# Altium project Laser Tag Bop-It.PrjPcb
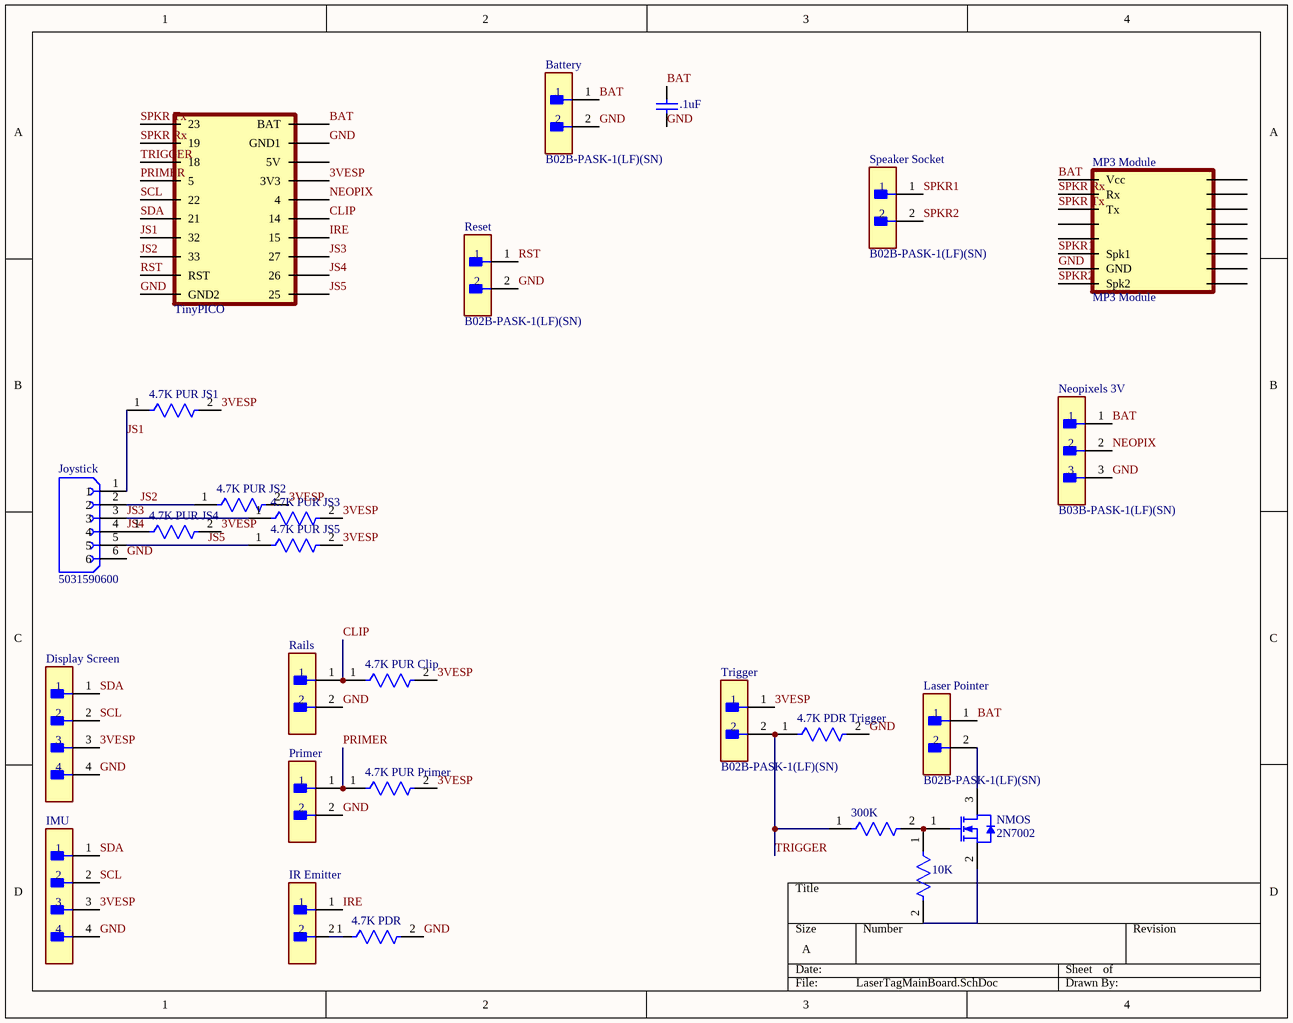
[diagram p0: LaserTagMainBoard.SchDoc]
4 sheets, 41 parts. Net scope: global (net labels, ports and power ports of the same name join across sheets).
Board files: LaserTagMainBoard.PcbDoc, LaserTagTargetBoard.PcbDoc, LaserTagNeopixelBoard.PcbDoc, LaserTagJoystickBoard.PcbDoc
Sheets:
  LaserTagMainBoard.SchDoc
  LaserTagTargetBoard.SchDoc
  LaserTagNeopixelBoard.SchDoc
  LaserTagJoystickBoard.SchDoc

## Sheet LaserTagMainBoard.SchDoc
size A; SheetNumber: 1; SheetTotal: 4

### Parts
4.7K_PDR  RC1206FR-074K7L  [FP-RC1206-0_65-IPC_B]  (value not drawn)
4.7K_PDR_Trigger  RC1206FR-074K7L  [FP-RC1206-0_65-IPC_B]  (value not drawn)
4.7K_PUR_Clip  RC1206FR-074K7L  [FP-RC1206-0_65-IPC_B]  (value not drawn)
4.7K_PUR_JS1  RC1206FR-074K7L  [FP-RC1206-0_65-IPC_B]  (value not drawn)
4.7K_PUR_JS2  RC1206FR-074K7L  [FP-RC1206-0_65-IPC_B]  (value not drawn)
4.7K_PUR_JS3  RC1206FR-074K7L  [FP-RC1206-0_65-IPC_B]  (value not drawn)
4.7K_PUR_JS4  RC1206FR-074K7L  [FP-RC1206-0_65-IPC_B]  (value not drawn)
4.7K_PUR_JS5  RC1206FR-074K7L  [FP-RC1206-0_65-IPC_B]  (value not drawn)
4.7K_PUR_Primer  RC1206FR-074K7L  [FP-RC1206-0_65-IPC_B]  (value not drawn)
10K  RMCF1206FT10K0  [FP-RMCF1206-IPC_B]  (value not drawn)
300K  RMCF1206JT300R  [FP-RMCF1206-IPC_B]  (value not drawn)
.1uF  C1206C104K5RACTU  [KEMT-1206-2_M]  (value not drawn)
Battery  B02B-PASK-1(LF)(SN)  [FP-B02B-PASK-1_LF_SN-MFG]
Display_Screen  B04B-PASK-1(LF)(SN)  [FP-B04B-PASK-1_LF_SN-MFG]  (value not drawn)
IMU  B04B-PASK-1(LF)(SN)  [FP-B04B-PASK-1_LF_SN-MFG]  (value not drawn)
IR_Emitter  B02B-PASK-1(LF)(SN)  [FP-B02B-PASK-1_LF_SN-MFG]  (value not drawn)
Joystick  5031590600  [MOLEX_5031590600]
Laser_Pointer  B02B-PASK-1(LF)(SN)  [FP-B02B-PASK-1_LF_SN-MFG]
MP3_Module  MP3 Module  [HW-247A]
Neopixels_3V  B03B-PASK-1(LF)(SN)  [FP-B03B-PASK-1_LF_SN-MFG]
NMOS  2N7002  [STM-SOT-23-3_V]
Primer  B02B-PASK-1(LF)(SN)  [FP-B02B-PASK-1_LF_SN-MFG]  (value not drawn)
Rails  B02B-PASK-1(LF)(SN)  [FP-B02B-PASK-1_LF_SN-MFG]  (value not drawn)
Reset  B02B-PASK-1(LF)(SN)  [FP-B02B-PASK-1_LF_SN-MFG]
Speaker_Socket  B02B-PASK-1(LF)(SN)  [FP-B02B-PASK-1_LF_SN-MFG]
Tiny_Pico_Microcontroller  TinyPICO  [TinyPICO]
Trigger  B02B-PASK-1(LF)(SN)  [FP-B02B-PASK-1_LF_SN-MFG]

### Nets
3VESP: 4.7K_PUR_Clip.2 4.7K_PUR_JS1.2 4.7K_PUR_JS2.2 4.7K_PUR_JS3.2 4.7K_PUR_JS4.2 4.7K_PUR_JS5.2 4.7K_PUR_Primer.2 Display_Screen.3 IMU.3 Tiny_Pico_Microcontroller.3V3 Trigger.1
BAT: .1uF.1 Battery.1 Laser_Pointer.1 MP3_Module.Vcc Neopixels_3V.1 Tiny_Pico_Microcontroller.BAT
CLIP: 4.7K_PUR_Clip.1 Rails.1 Tiny_Pico_Microcontroller.14
GND: 4.7K_PDR.2 4.7K_PDR_Trigger.2 .1uF.2 Battery.2 Display_Screen.4 IMU.4 Joystick.6 MP3_Module.GND Neopixels_3V.3 Primer.2 Rails.2 Reset.2 Tiny_Pico_Microcontroller.GND1 Tiny_Pico_Microcontroller.GND2
IRE: IR_Emitter.1 Tiny_Pico_Microcontroller.15
JS1: 4.7K_PUR_JS1.1 Joystick.1 Tiny_Pico_Microcontroller.32
JS2: 4.7K_PUR_JS2.1 Joystick.2 Tiny_Pico_Microcontroller.33
JS3: 4.7K_PUR_JS3.1 Joystick.3 Tiny_Pico_Microcontroller.27
JS4: 4.7K_PUR_JS4.1 Joystick.4 Tiny_Pico_Microcontroller.26
JS5: 4.7K_PUR_JS5.1 Joystick.5 Tiny_Pico_Microcontroller.25
NEOPIX: Neopixels_3V.2 Tiny_Pico_Microcontroller.4
PRIMER: 4.7K_PUR_Primer.1 Primer.1 Tiny_Pico_Microcontroller.5
RST: Reset.1 Tiny_Pico_Microcontroller.RST
SCL: Display_Screen.2 IMU.2 Tiny_Pico_Microcontroller.22
SDA: Display_Screen.1 IMU.1 Tiny_Pico_Microcontroller.21
SPKR1: MP3_Module.Spk1 Speaker_Socket.1
SPKR2: MP3_Module.Spk2 Speaker_Socket.2
SPKR Rx: MP3_Module.Rx Tiny_Pico_Microcontroller.19
SPKR Tx: MP3_Module.Tx Tiny_Pico_Microcontroller.23
TRIGGER: 4.7K_PDR_Trigger.1 300K.1 Tiny_Pico_Microcontroller.18 Trigger.2
Net4.7K_PDR_1: 4.7K_PDR.1 IR_Emitter.2
Net10K_1: 10K.1 300K.2 NMOS.1(G)
Net10K_2: 10K.2 NMOS.2(S)
NetLaser_Pointer_2: Laser_Pointer.2 NMOS.3(D)

Not connected (* = marked no-connect by the designer): MP3_Module 01(NA) 02(NA) 03(NA) 04(NA) 05(NA) 06(NA) 07(NA) 08(NA) 09(NA) 10(NA); Tiny_Pico_Microcontroller 5V

### Library data of the parts
4.7K_PDR 4.7K_PDR_Trigger 4.7K_PUR_Clip 4.7K_PUR_JS1-4.7K_PUR_JS5 4.7K_PUR_Primer = CMP-03412-037805-1: RES SMD 4.7K OHM 1% 1/4W 1206; Max Power Dissipation: 250mW; Voltage Rating: 200V; Temperature Coefficient: 100ppm/°C; Resistance: 4.7kR; Construction: Rectangular; RoHS Compliant: Yes; Max Operating Temperature: 155°C; Tolerance: 1%; Height: 0.026inch; Features: Moisture Resistant; Military Standard: Not; Series: RC; Termination: SMD/SMT; Number of Terminations: 2; Number of Pins: 2; Case Code (Imperial): 1206; Case/Package: 1206; Case Code (Metric): 3216; Voltage Rating (DC): 200V; Width: 0.063inch; Min Operating Temperature: -55°C; Resistance Tolerance: 1%; Length: 0.122inch; Size Code: 1206; Lead Free: Lead Free; Depth: 1.6mm; Packaging: Tape and Reel; Package Quantity: 1; Power Rating: 250mW; Resistor Type: Thick Film
10K = CMP-26527-000151-1: 10kΩ ±1% 0.25W 1206 Thick Film Chip Resistor AEC-Q200 compliant; Resistance: 10kR; Temperature Coefficient: 100ppm/°C; Max Power Dissipation: 250mW; Packaging: Tape and Reel; Resistor Type: Thick Film; Number of Terminations: 2; Depth: 1.6mm; Military Standard: Not; Contact Plating: Tin; Radiation Hardening: No; Lead Free: Lead Free; Tolerance: 1%; Length: 3.2mm; Size Code: 1206; RoHS Compliant: Yes; Case/Package: 1206; Mount: Surface Mount; Features: Automotive AEC-Q200; Min Operating Temperature: -55°C; Series: RMCF; Case Code (Imperial): 1206; Construction: Rectangular; Max Operating Temperature: 155°C; Width: 0.063inch; Height: 0.028inch; Power Rating: 250mW; Case Code (Metric): 3216
300K = CMP-26527-001830-1: 300Ω ±5% 0.25W 1206 Thick Film Chip Resistor AEC-Q200 compliant; Temperature Coefficient: 200ppm/°C; Resistance: 300R; Max Power Dissipation: 250mW; Packaging: Tape and Reel; Case Code (Metric): 3216; Resistor Type: Thick Film; Depth: 1.6mm; Contact Plating: Tin; Radiation Hardening: No; Max Operating Temperature: 155°C; Series: RMCF; Construction: Rectangular; Mount: Surface Mount; Width: 0.063inch; Tolerance: 5%; RoHS Compliant: Yes; Height: 0.028inch; Number of Terminations: 2; Case Code (Imperial): 1206; Features: Automotive AEC-Q200; Length: 3.2mm; Lead Free: Lead Free; Military Standard: Not; Min Operating Temperature: -55°C; Case/Package: 1206
.1uF = CMP-1037-04202-2: CAP, Ceramic, 0.1 uF, +/- 10%, 50 V, -55 to 125 degC, 1206 (3216 Metric), RoHS, Tape and Reel; Manufacturer: Kemet; Voltage Rating: 50V; Capacitance: 0.1µF; Product Range: KEMET-CSeries; SVHC: ToBeAdvised; Dielectric Characteristic: X7R; Capacitor Case Style: 1206[3216Metric]; Package Reference: 1206-2; Package Description: 2-Leads SMD, Body 3.2 x 1.6 mm; Packaging: Tape&Reel; Operating Temperature Max: 125degC; Capacitance Tolerance: ±10%; Datasheet URL: https://datasheet.ciiva.com/6125/1725438-6125494.pdf; Manufacturer URL: http://www.kemet.com/; Operating Temperature Min: -55degC; Datasheet Version: Jul-13
Battery IR_Emitter Laser_Pointer Primer Rails Reset Speaker_Socket Trigger = CMP-17439-000415-1: CONN HEADER VERT 2POS 2MM; Number of Contacts: 2; Current Rating: 3A; Insulation Resistance: 1GR; Mated Stacking Heights: 14.9mm; Voltage Rating: 250V; Gender: Male; Pitch: 2mm; Orientation: Straight; Contact Finish - Mating: TIN; Mount: Through Hole; Contact Type: Male Pin; Number of Rows: 1; Fastening Type: Ramp; Series: PA; Connector Type: Header; Insulation Color: Natural; Flammability Rating: UL94 V-0; Material: Polybutylene; Contact Shape: Square; Contact Plating: Tin; Insulation Material: PBT; Max Operating Temperature: 85°C; Housing Color: White; Number of Positions: 2; Contact Material: Copper Alloy; Min Operating Temperature: -25°C; Lead Free: Lead Free; Contact Mating Length: 0.126inch; Termination: Solder; Packaging: Bulk; Color: Natural
Display_Screen IMU = CMP-17439-000192-1: CONN HEADER VERT 4POS 2MM; Voltage Rating: 250V; Number of Positions: 4; Current Rating: 3A; Mated Stacking Heights: 14.9mm; Gender: Male; Contact Resistance: 20mR; Termination: Solder; Length: 10mm; Number of Rows: 1; Depth: 5.3mm; Contact Plating: Copper; Packaging: Bulk; Housing Color: White; Contact Shape: Square; Contact Mating Length: 0.126inch; Color: Natural; Min Operating Temperature: -25°C; Fastening Type: Ramp; Max Current Rating: 3A; Lead Free: Lead Free; Flammability Rating: UL94 V-0; Connector Type: Header; Contact Finish - Mating: TIN; Max Voltage Rating (AC): 250V; Mount: Through Hole; Number of Contacts: 4; Orientation: Straight; Series: PA; Pitch: 2mm; Insulation Color: Natural; Contact Material: Copper Alloy; Max Operating Temperature: 85°C; Contact Type: Male Pin; Insulation Material: PBT
Joystick = 5031590600: 1.50mm Pitch, CLIK-Mate PCB Receptacle, Single Row, Through Hole, Vertical, Tin Plating, Positive Lock, with Peg, 6 Circuits, Natural; Price: None; Availability: Unavailable; Value: *; MP: 5031590600; Package: None
MP3_Module = Component_1
Neopixels_3V = CMP-17439-000193-1: CONN HEADER VERT 3POS 2MM; Voltage Rating: 250V; Current Rating: 3A; Mated Stacking Heights: 14.9mm; Number of Positions: 3; Packaging: Bulk; Contact Type: Male Pin; Flammability Rating: UL94 V-0; Contact Shape: Square; Number of Rows: 1; Color: Natural; Orientation: Straight; Housing Color: White; Fastening Type: Ramp; Insulation Material: PBT; Insulation Color: Natural; Mount: Through Hole; Contact Finish - Mating: TIN; Connector Type: Header; Termination: Solder; Contact Mating Length: 0.126inch; Lead Free: Lead Free; Contact Material: Copper Alloy; Pitch: 2mm; Series: PA; Number of Contacts: 3; Contact Plating: Tin
NMOS = CMP-0434-00001-1: N-channel 60 V, 1.8 Ohm, 0.35 A STripFET(TM) II Power MOSFET, SOT23; Manufacturer: STMicroelectronics; PartNumber: 2N7002; ComponentLink2Description: Datasheet; ComponentLink2URL: http://www.st.com/st-web-ui/static/active/en/resource/technical/document/datasheet/CD00005134.pdf; ComponentLink1Description: Manufacturer URL; ComponentLink1URL: http://www.st.com/; DatasheetVersion: Rev. 9, 11/2008; PackageReference: SOT-23; Mounting Technology: Surface Mount; PackageDescription: 3-Pin SOT23, 3.016 x 2.8 mm Body, 0.95 mm Pitch

## Sheet LaserTagTargetBoard.SchDoc
size A; SheetNumber: 2; SheetTotal: 2
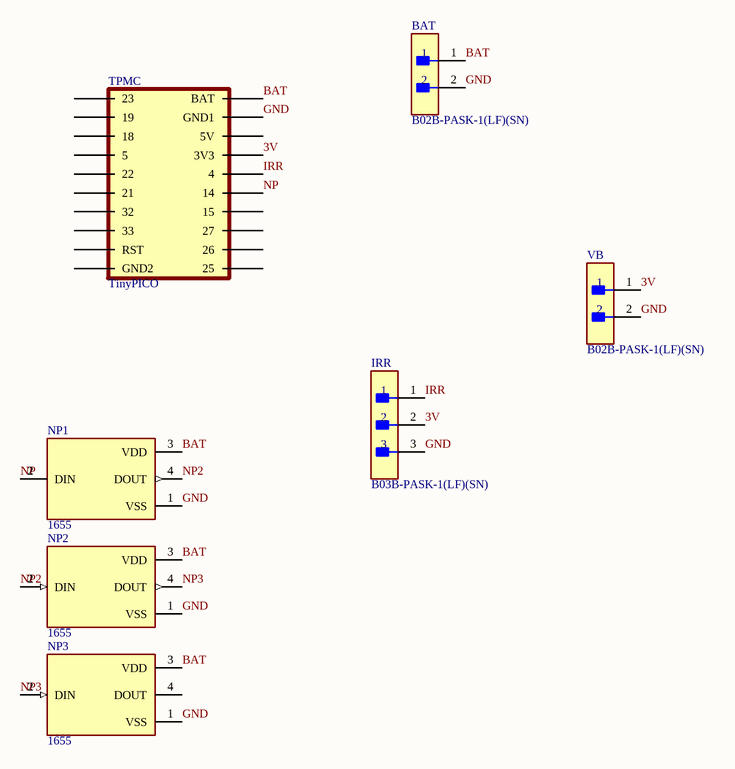
[diagram p1: LaserTagTargetBoard.SchDoc]

### Parts
BAT  B02B-PASK-1(LF)(SN)  [FP-B02B-PASK-1_LF_SN-MFG]
IRR  B03B-PASK-1(LF)(SN)  [FP-B03B-PASK-1_LF_SN-MFG]
NP1  1655  [LED_1655]
NP2  1655  [LED_1655]
NP3  1655  [LED_1655]
TPMC  TinyPICO  [TinyPICO]
VB  B02B-PASK-1(LF)(SN)  [FP-B02B-PASK-1_LF_SN-MFG]

### Nets
3V: IRR.2 TPMC.3V3 VB.1
BAT: BAT.1 NP1.3(VDD) NP2.3(VDD) NP3.3(VDD) TPMC.BAT
GND: BAT.2 IRR.3 NP1.1(VSS) NP2.1(VSS) NP3.1(VSS) TPMC.GND1 VB.2
IRR: IRR.1 TPMC.4
NP: NP1.2(DIN) TPMC.14
NP2: NP1.4(DOUT) NP2.2(DIN)
NP3: NP2.4(DOUT) NP3.2(DIN)

Not connected (* = marked no-connect by the designer): NP3 4(DOUT); TPMC 5 5V 15 18 19 21 22 23 25 26 27 32 33 GND2 RST

### Library data of the parts
BAT VB = CMP-17439-000415-1: as Battery on sheet LaserTagMainBoard; Pitch: 2mm; Orientation: Straight; Contact Finish - Mating: TIN; Mount: Through Hole; Contact Type: Male Pin; Number of Rows: 1; Fastening Type: Ramp; Series: PA; Connector Type: Header; Insulation Color: Natural; Flammability Rating: UL94 V-0; Material: Polybutylene; Contact Shape: Square; Contact Plating: Tin; Insulation Material: PBT; Max Operating Temperature: 85°C; Housing Color: White; Number of Positions: 2; Contact Material: Copper Alloy; Min Operating Temperature: -25°C; Lead Free: Lead Free; Contact Mating Length: 0.126inch; Termination: Solder; Packaging: Bulk; Color: Natural
IRR = CMP-17439-000193-1: as Neopixels_3V on sheet LaserTagMainBoard; Packaging: Bulk; Contact Type: Male Pin; Flammability Rating: UL94 V-0; Contact Shape: Square; Number of Rows: 1; Color: Natural; Orientation: Straight; Housing Color: White; Fastening Type: Ramp; Insulation Material: PBT; Insulation Color: Natural; Mount: Through Hole; Contact Finish - Mating: TIN; Connector Type: Header; Termination: Solder; Contact Mating Length: 0.126inch; Lead Free: Lead Free; Contact Material: Copper Alloy; Pitch: 2mm; Series: PA; Number of Contacts: 3; Contact Plating: Tin
NP1-NP3 = 1655: Ws2812b 5050 Rgb Led With Integrated Driver Chip Pack Of 10; Package: None; MP: 1655; Price: None; Availability: Unavailable; Value: *

## Sheet LaserTagNeopixelBoard.SchDoc
size A; SheetNumber: 3; SheetTotal: 3
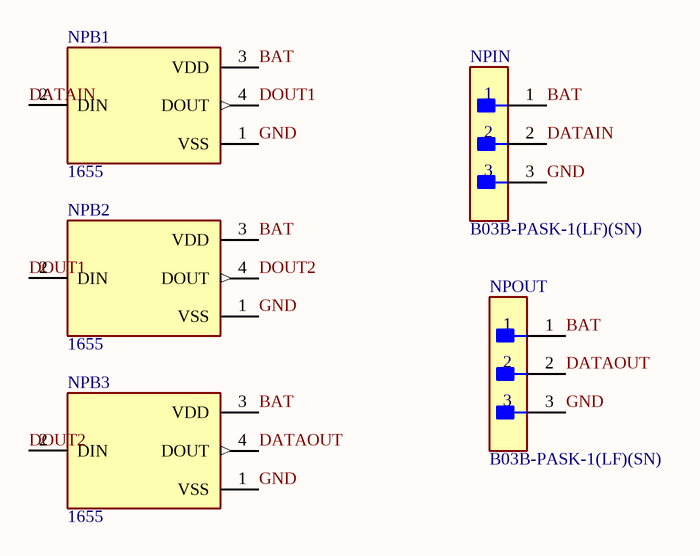
[diagram p2: LaserTagNeopixelBoard.SchDoc]

### Parts
NPB1  1655  [LED_1655]
NPB2  1655  [LED_1655]
NPB3  1655  [LED_1655]
NPIN  B03B-PASK-1(LF)(SN)  [FP-B03B-PASK-1_LF_SN-MFG]
NPOUT  B03B-PASK-1(LF)(SN)  [FP-B03B-PASK-1_LF_SN-MFG]

### Nets
BAT: NPB1.3(VDD) NPB2.3(VDD) NPB3.3(VDD) NPIN.1 NPOUT.1
DATAIN: NPB1.2(DIN) NPIN.2
DATAOUT: NPB3.4(DOUT) NPOUT.2
DOUT1: NPB1.4(DOUT) NPB2.2(DIN)
DOUT2: NPB2.4(DOUT) NPB3.2(DIN)
GND: NPB1.1(VSS) NPB2.1(VSS) NPB3.1(VSS) NPIN.3 NPOUT.3

### Library data of the parts
NPB1-NPB3 = 1655: as NP1 on sheet LaserTagTargetBoard; Package: None; MP: 1655; Price: None; Availability: Unavailable; Value: *
NPIN NPOUT = CMP-17439-000193-1: as Neopixels_3V on sheet LaserTagMainBoard; Packaging: Bulk; Contact Type: Male Pin; Flammability Rating: UL94 V-0; Contact Shape: Square; Number of Rows: 1; Color: Natural; Orientation: Straight; Housing Color: White; Fastening Type: Ramp; Insulation Material: PBT; Insulation Color: Natural; Mount: Through Hole; Contact Finish - Mating: TIN; Connector Type: Header; Termination: Solder; Contact Mating Length: 0.126inch; Lead Free: Lead Free; Contact Material: Copper Alloy; Pitch: 2mm; Series: PA; Number of Contacts: 3; Contact Plating: Tin

## Sheet LaserTagJoystickBoard.SchDoc
size A; SheetNumber: 4; SheetTotal: 4
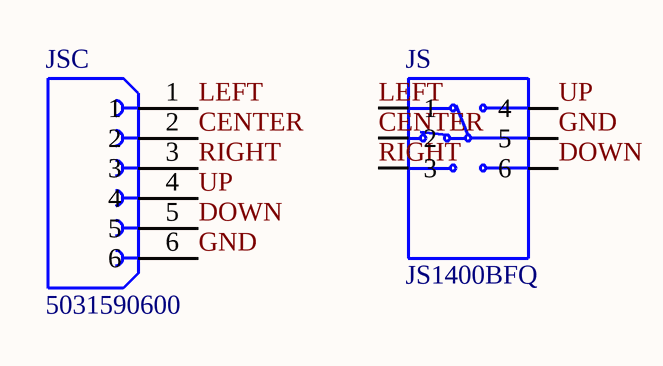
[diagram p3: LaserTagJoystickBoard.SchDoc]

### Parts
JS  JS1400BFQ  [SW_JS1400BFQ]
JSC  5031590600  [MOLEX_5031590600]

### Nets
CENTER: JS.2 JSC.2
DOWN: JS.6 JSC.5
GND: JS.5 JSC.6
LEFT: JS.1 JSC.1
RIGHT: JS.3 JSC.3
UP: JS.4 JSC.4

Not connected (* = marked no-connect by the designer): JS SH1(SHIELD) SH2(SHIELD)

### Library data of the parts
JS = JS1400BFQ: Navigation Switch, 2 - Axis Digital (Mechanical Switch) Output; MF: E-Switch; Digi-Key_Part_Number: EG5858-ND; MP: JS1400BFQ; Value: *; SnapEDA_Link: https://www.snapeda.com/parts/JS1400BFQ/E-Switch/view-part/2768291/?ref=snap; Package: None
JSC = 5031590600: as Joystick on sheet LaserTagMainBoard; Price: None; Availability: Unavailable; Value: *; MP: 5031590600; Package: None

## Nets that join several sheets
BAT: LaserTagMainBoard (6 pins), LaserTagTargetBoard (5 pins), LaserTagNeopixelBoard (5 pins)
GND: LaserTagMainBoard (14 pins), LaserTagTargetBoard (7 pins), LaserTagNeopixelBoard (5 pins), LaserTagJoystickBoard (JS.5 JSC.6)